# EAGLE schematic HTH-2019-Badge-PROD-RC1 (EAGLE 9.3.2)
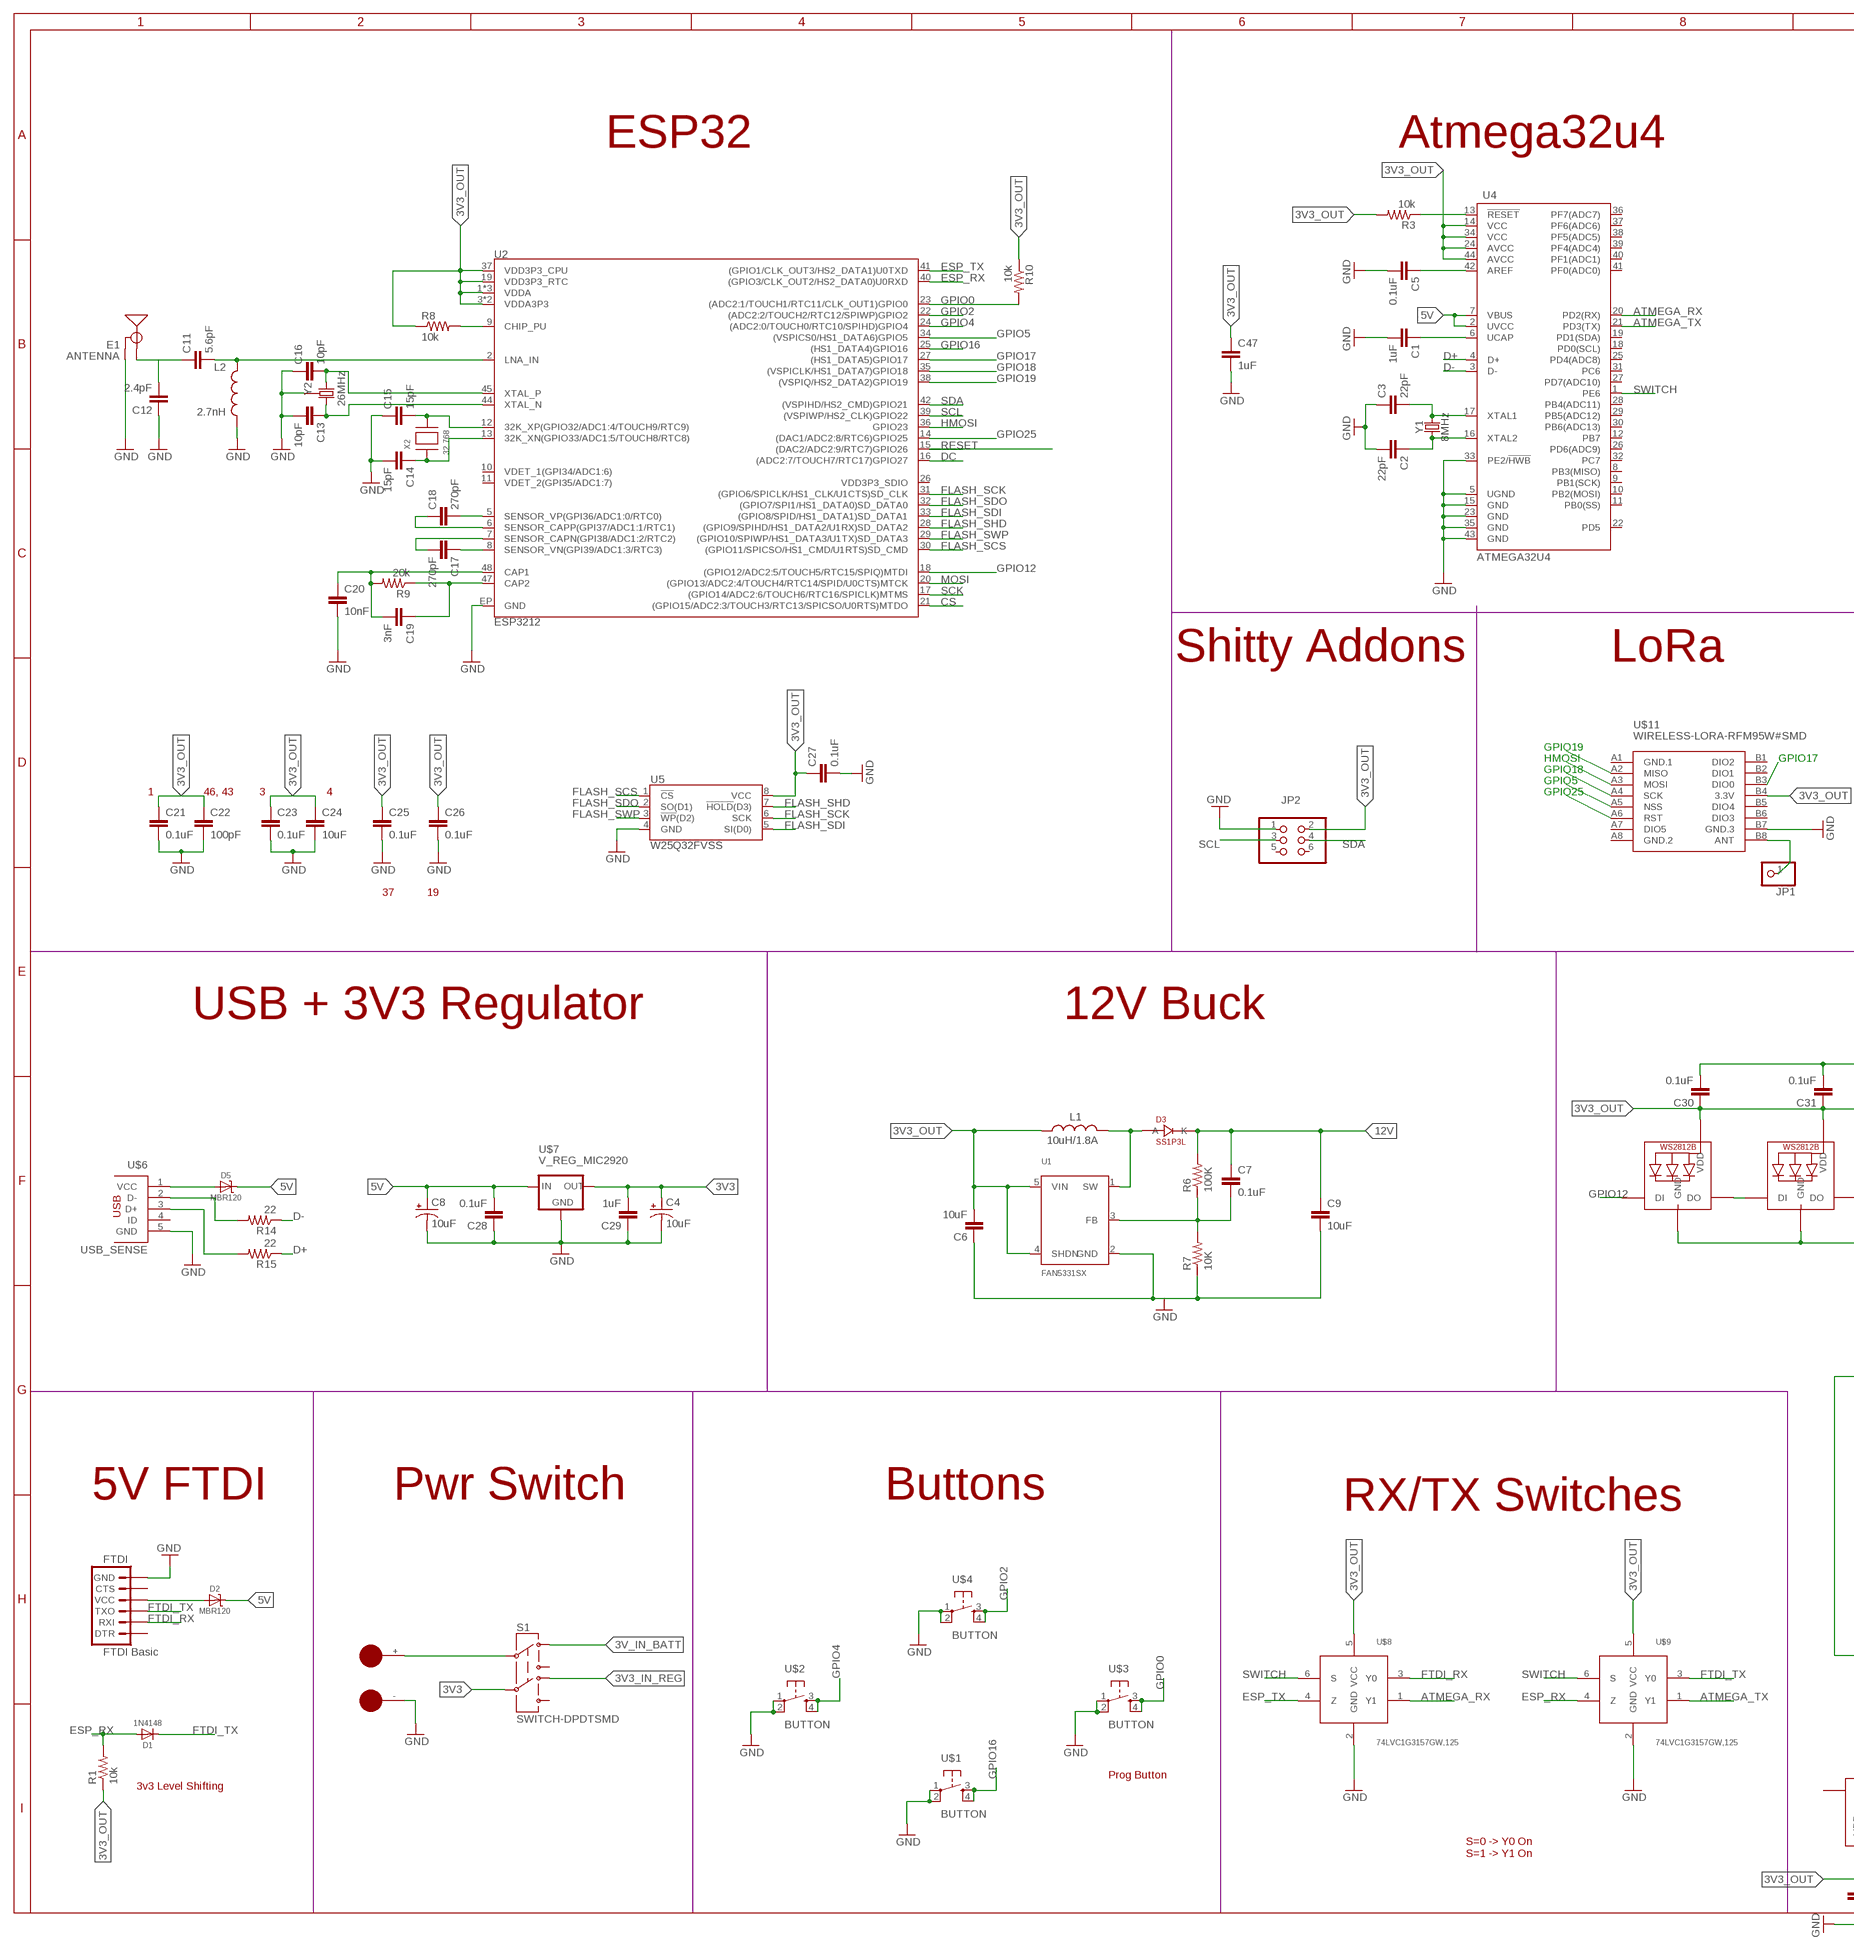
[diagram p0: schematic, sheet 1, part 1 of 2]
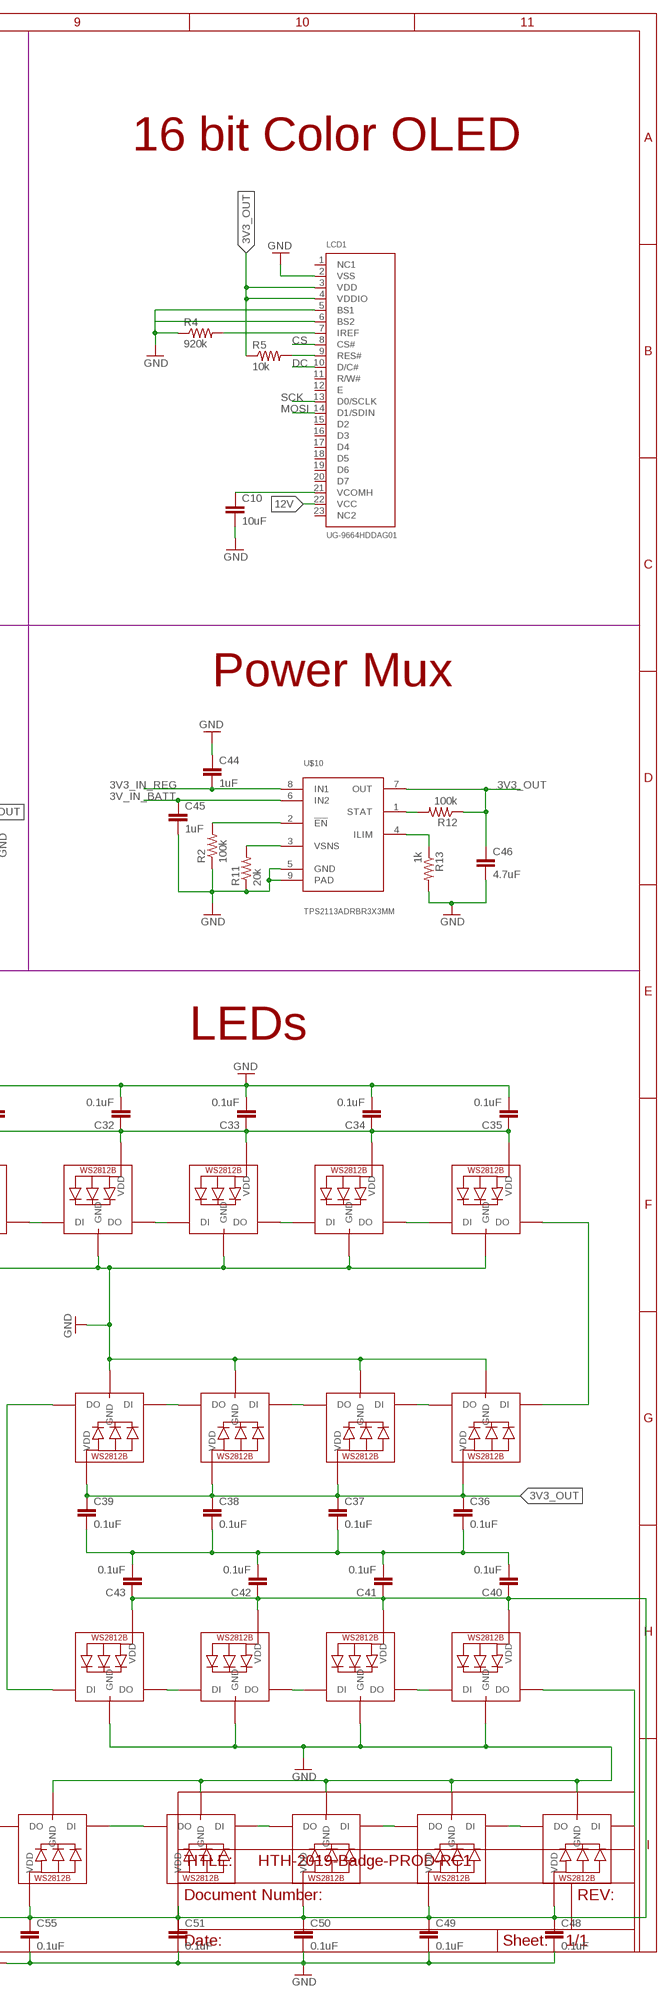
[diagram p1: schematic, sheet 1, part 2 of 2]

## Parts
C1  1uF  CAP-0603-EMPTY-VALUES  [CAP0603]
C2  22pF  CAP-0603-EMPTY-VALUES  [CAP0603]
C3  22pF  CAP-0603-EMPTY-VALUES  [CAP0603]
C4  10uF  CAP_POL1206  [EIA3216]
C5  0.1uF  CAP-0603-EMPTY-VALUES  [CAP0603]
C6  10uF  CAP-0603-10UF-10V-10%  [CAP0603]
C7  0.1uF  CAP-0603-0.1UF-25V-10%  [CAP0603]
C8  10uF  CAP_POL1206  [EIA3216]
C9  10uF  CAP-0603-10UF-25V-20%  [CAP0603]
C10  10uF  CAP-0603-EMPTY-VALUES  [CAP0603]
C11  5.6pF  CAP-0603-EMPTY-VALUES  [CAP0603]
C12  2.4pF  CAP-0603-EMPTY-VALUES  [CAP0603]
C13  10pF  CAP-0603-EMPTY-VALUES  [CAP0603]
C14  15pF  CAP-0603-EMPTY-VALUES  [CAP0603]
C15  15pF  CAP-0603-EMPTY-VALUES  [CAP0603]
C16  10pF  CAP-0603-EMPTY-VALUES  [CAP0603]
C17  270pF  CAP-0603-EMPTY-VALUES  [CAP0603]
C18  270pF  CAP-0603-EMPTY-VALUES  [CAP0603]
C19  3nF  CAP-0603-EMPTY-VALUES  [CAP0603]
C20  10nF  CAP-0603-EMPTY-VALUES  [CAP0603]
C21  0.1uF  CAP-0603-EMPTY-VALUES  [CAP0603]
C22  100pF  CAP-0603-EMPTY-VALUES  [CAP0603]
C23  0.1uF  CAP-0603-EMPTY-VALUES  [CAP0603]
C24  10uF  CAP-0603-EMPTY-VALUES  [CAP0603]
C25  0.1uF  CAP-0603-EMPTY-VALUES  [CAP0603]
C26  0.1uF  CAP-0603-EMPTY-VALUES  [CAP0603]
C27  0.1uF  CAP-0603-EMPTY-VALUES  [CAP0603]
C28  0.1uF  CAP-0603-EMPTY-VALUES  [CAP0603]
C29  1uF  CAP-0603-EMPTY-VALUES  [CAP0603]
C30  0.1uF  CAP-0603-EMPTY-VALUES  [CAP0603]
C31  0.1uF  CAP-0603-EMPTY-VALUES  [CAP0603]
C32  0.1uF  CAP-0603-EMPTY-VALUES  [CAP0603]
C33  0.1uF  CAP-0603-EMPTY-VALUES  [CAP0603]
C34  0.1uF  CAP-0603-EMPTY-VALUES  [CAP0603]
C35  0.1uF  CAP-0603-EMPTY-VALUES  [CAP0603]
C36  0.1uF  CAP-0603-EMPTY-VALUES  [CAP0603]
C37  0.1uF  CAP-0603-EMPTY-VALUES  [CAP0603]
C38  0.1uF  CAP-0603-EMPTY-VALUES  [CAP0603]
C39  0.1uF  CAP-0603-EMPTY-VALUES  [CAP0603]
C40  0.1uF  CAP-0603-EMPTY-VALUES  [CAP0603]
C41  0.1uF  CAP-0603-EMPTY-VALUES  [CAP0603]
C42  0.1uF  CAP-0603-EMPTY-VALUES  [CAP0603]
C43  0.1uF  CAP-0603-EMPTY-VALUES  [CAP0603]
C44  1uF  CAP-0603-EMPTY-VALUES  [CAP0603]
C45  1uF  CAP-0603-EMPTY-VALUES  [CAP0603]
C46  4.7uF  CAP-0603-EMPTY-VALUES  [CAP0603]
C47  1uF  CAP-0603-EMPTY-VALUES  [CAP0603]
C48  0.1uF  CAP-0603-EMPTY-VALUES  [CAP0603]
C49  0.1uF  CAP-0603-EMPTY-VALUES  [CAP0603]
C50  0.1uF  CAP-0603-EMPTY-VALUES  [CAP0603]
C51  0.1uF  CAP-0603-EMPTY-VALUES  [CAP0603]
C55  0.1uF  CAP-0603-EMPTY-VALUES  [CAP0603]
D1  1N4148  DIODESOD-323  [SOD-323]
D2  MBR120  DIODE-SCHOTTKYSOD-123  [SOD-123]
D3  SS1P3L  [DO220AAL]
D5  MBR120  DIODE-SCHOTTKYSOD-123  [SOD-123]
E1  ANTENNA  ANTENNATRACE-TUNED  [TRACE_ANTENNA_2.4GHZ_25.7MM_TUNED]
FTDI  FTDI Basic  ARDUINO_SERIAL_PROGRAMPTH  [1X06]
JP1  PINHD-1X1  [1X01]
JP2  PINHD-2X3  [2X03]
L1  10uH/1.8A  INDUCTORSRU5028  [SRU5028]
L2  2.7nH  INDUCTOR0603  [0603]
LCD1  UG-9664HDDAG01  DISP_OLED_UG-9664HDDAG01WRAPAROUND  [UG-9664HDDAG01_WRAPAROUND]
LED1  WS2812B3535  [LED3535]
LED2  WS2812B3535  [LED3535]
LED3  WS2812B3535  [LED3535]
LED4  WS2812B3535  [LED3535]
LED5  WS2812B3535  [LED3535]
LED6  WS2812B3535  [LED3535]
LED7  WS2812B3535  [LED3535]
LED8  WS2812B3535  [LED3535]
LED9  WS2812B3535  [LED3535]
LED10  WS2812B3535  [LED3535]
LED11  WS2812B3535  [LED3535]
LED12  WS2812B3535  [LED3535]
LED13  WS2812B3535  [LED3535]
LED14  WS2812B3535  [LED3535]
LED15  WS2812B3535  [LED3535]
LED16  WS2812B3535  [LED3535]
LED17  WS2812B3535  [LED3535]
LED18  WS2812B3535  [LED3535]
LED19  WS2812B3535  [LED3535]
R1  10k  RES-0603_EMPTY-FIELDS  [RES-0603]
R2  100k  RES-0603_EMPTY-FIELDS  [RES-0603]
R3  10k  RES-0603_EMPTY-FIELDS  [RES-0603]
R4  920k  RES-0603_EMPTY-FIELDS  [RES-0603]
R5  10k  RES-0603_EMPTY-FIELDS  [RES-0603]
R6  100K  RES-0603-100K-5%  [RES-0603]
R7  10K  RES-0603-10K-5%  [RES-0603]
R8  10k  RES-0603_EMPTY-FIELDS  [RES-0603]
R9  20k  RES-0603_EMPTY-FIELDS  [RES-0603]
R10  10k  RES-0603_EMPTY-FIELDS  [RES-0603]
R11  20k  RES-0603_EMPTY-FIELDS  [RES-0603]
R12  100k  RES-0603_EMPTY-FIELDS  [RES-0603]
R13  1k  RES-0603_EMPTY-FIELDS  [RES-0603]
R14  22  RES-0603_EMPTY-FIELDS  [RES-0603]
R15  22  RES-0603_EMPTY-FIELDS  [RES-0603]
S1  SWITCH-DPDTSMD  [AYZ0202]
U1  FAN5331SX  FAN5331  [SOT23-5]
U2  ESP3212  [QFN48-0.4MM]
U4  ATMEGA32U4  ATMEGA32U4OUTFAKES  [QFN-44-NOPAD_1:1-OUTFAKES]
U5  W25Q32FVSS  [SOIC-8]
U$1  BUTTON  [BUTTON]
U$2  BUTTON  [BUTTON]
U$3  BUTTON  [BUTTON]
U$4  BUTTON  [BUTTON]
U$5  BAT_HOLD  [AA]
U$6  USB_SENSE  [USB-MICRO-TH-SUPPORT]
U$7  V_REG_MIC2920  [SOT223]
U$8  74LVC1G3157GW,125  [SOT-363]
U$9  74LVC1G3157GW,125  [SOT-363]
U$10  TPS2113ADRBR3X3MM  [8-VDFN]
U$11  WIRELESS-LORA-RFM95W#SMD  [WIRELESS-LORA-RFM95W#SMD]
X2  32.768  XTAL-3.2X1.5  [XTAL3215]
Y1  8MHz  CRYSTAL-8MHZSMD-5X3.2  [CRYSTAL-SMD-5X3.2-4PAD]
Y2  26MHz  CRYSTAL-GROUNDED3.2X2.5  [CRYSTAL-SMD-3.2X2.5]

## Nets
3V3: C4.A(+) C29.2 S1.5 U$7.3(OUT)
3V3_IN_REG: C44.2 S1.4 U$10.8(IN1)
3V3_OUT: C6.2 C21.1 C22.1 C23.1 C24.1 C25.1 C26.1 C27.1 C30.1 C31.1 C32.1 C33.1 C34.1 C35.1 C36.1 C37.1 C38.1 C39.1 C40.1 C41.1 C42.1 C43.1 C46.1 C47.1 C48.1 C49.1 C50.1 C51.1 C55.1 JP2.2 L1.1 LCD1.3(VDD) LCD1.4(VDDIO) LED1.2(VDD) LED2.2(VDD) LED3.2(VDD) LED4.2(VDD) LED5.2(VDD) LED6.2(VDD) LED7.2(VDD) LED8.2(VDD) LED9.2(VDD) LED10.2(VDD) LED11.2(VDD) LED12.2(VDD) LED13.2(VDD) LED14.2(VDD) LED15.2(VDD) LED16.2(VDD) LED17.2(VDD) LED18.2(VDD) LED19.2(VDD) R1.1 R3.2 R5.1 R8.1 R10.1 R12.1 U1.4(SHDN) U1.5(VIN) U2.1(VDDA) U2.3(VDDA3P3) U2.4(VDDA3P3) U2.19(VDD3P3_RTC) U2.37(VDD3P3_CPU) U2.43(VDDA) U2.46(VDDA) U4.14(VCC) U4.24(AVCC) U4.34(VCC) U4.44(AVCC) U5.8(VCC) U$8.5(VCC) U$9.5(VCC) U$10.7(OUT) U$11.B4(3.3V)
3V_IN_BATT: C45.1 S1.1 U$10.6(IN2)
5V: C8.A(+) C28.2 D2.C D5.C U4.2(UVCC) U4.7(VBUS) U$7.1(IN)
12V: C7.1 C9.1 D3.P$1(K) LCD1.22(VCC) R6.2
ATMEGA_RX: U4.20(PD2(RX)) U$8.1(Y1)
ATMEGA_TX: U4.21(PD3(TX)) U$9.1(Y1)
CS: LCD1.8(CS#) U2.21((GPIO15/ADC2:3/TOUCH3/RTC13/SPICSO/U0RTS)MTDO)
D+: R15.1 U4.4(D+)
D-: R14.1 U4.3(D-)
DC: LCD1.10(D/C#) U2.16((ADC2:7/TOUCH7/RTC17)GPIO27)
ESP_RX: D1.A R1.2 U2.40((GPIO3/CLK_OUT2/HS2_DATA0)U0RXD) U$9.4(Z)
ESP_TX: U2.41((GPIO1/CLK_OUT3/HS2_DATA1)U0TXD) U$8.4(Z)
FLASH_SCK: U2.31((GPIO6/SPICLK/HS1_CLK/U1CTS)SD_CLK) U5.6(SCK)
FLASH_SCS: U2.30((GPIO11/SPICSO/HS1_CMD/U1RTS)SD_CMD) U5.1(!CS!)
FLASH_SDI: U2.33((GPIO8/SPID/HS1_DATA1)SD_DATA1) U5.5(SI(D0))
FLASH_SDO: U2.32((GPIO7/SPI1/HS1_DATA0)SD_DATA0) U5.2(SO(D1))
FLASH_SHD: U2.28((GPIO9/SPIHD/HS1_DATA2/U1RX)SD_DATA2) U5.7(!HOLD!(D3))
FLASH_SWP: U2.29((GPIO10/SPIWP/HS1_DATA3/U1TX)SD_DATA3) U5.3(!WP!(D2))
FTDI_RX: FTDI.2(RXI) U$8.3(Y0)
FTDI_TX: D1.C FTDI.3(TXO) U$9.3(Y0)
GND: C1.2 C2.2 C3.1 C4.C(-) C5.2 C6.1 C8.C(-) C9.2 C10.2 C12.1 C13.2 C14.2 C15.1 C16.1 C20.2 C21.2 C22.2 C23.2 C24.2 C25.2 C26.2 C27.2 C28.1 C29.1 C30.2 C31.2 C32.2 C33.2 C34.2 C35.2 C44.1 C45.2 C46.2 C47.2 C48.2 C49.2 C50.2 C51.2 C55.2 E1.GND E1.GND2(GND) FTDI.6(GND) JP2.1 L2.2 LCD1.2(VSS) LCD1.5(BS1) LED1.4(GND) LED2.4(GND) LED3.4(GND) LED4.4(GND) LED5.4(GND) LED6.4(GND) LED7.4(GND) LED8.4(GND) LED9.4(GND) LED10.4(GND) LED11.4(GND) LED12.4(GND) LED13.4(GND) LED14.4(GND) LED15.4(GND) LED16.4(GND) LED17.4(GND) LED18.4(GND) LED19.4(GND) R2.1 R4.1 R7.1 R11.1 R13.2 U1.2(GND) U2.EP(GND) U4.5(UGND) U4.15(GND) U4.23(GND) U4.33(PE2/!HWB) U4.35(GND) U4.43(GND) U5.4(GND) U$1.1 U$1.2 U$2.1 U$2.2 U$3.1 U$3.2 U$4.1 U$4.2 U$5.- U$6.5(GND) U$7.2(GND) U$7.4(GND) U$8.2(GND) U$9.2(GND) U$10.5(GND) U$10.9(PAD) U$11.B7(GND.3) Y2.2(GND) Y2.4(GND)
GPIO0: R10.2 U2.23((ADC2:1/TOUCH1/RTC11/CLK_OUT1)GPIO0) U$3.3 U$3.4
GPIO2: U2.22((ADC2:2/TOUCH2/RTC12/SPIWP)GPIO2) U$4.3 U$4.4
GPIO4: U2.24((ADC2:0/TOUCH0/RTC10/SPIHD)GPIO4) U$2.3 U$2.4
GPIO5: U2.34((VSPICS0/HS1_DATA6)GPIO5) U$11.A5(NSS)
GPIO12: LED5.1(DI) U2.18((GPIO12/ADC2:5/TOUCH5/RTC15/SPIQ)MTDI)
GPIO16: U2.25((HS1_DATA4)GPIO16) U$1.3 U$1.4
GPIO17: U2.27((HS1_DATA5)GPIO17) U$11.B3(DIO0)
GPIO18: U2.35((VSPICLK/HS1_DATA7)GPIO18) U$11.A4(SCK)
GPIO19: U2.38((VSPIQ/HS2_DATA2)GPIO19) U$11.A2(MISO)
GPIO25: U2.14((DAC1/ADC2:8/RTC6)GPIO25) U$11.A6(RST)
HMOSI: U2.36(GPIO23) U$11.A3(MOSI)
MOSI: LCD1.14(D1/SDIN) U2.20((GPIO13/ADC2:4/TOUCH4/RTC14/SPID/U0CTS)MTCK)
N$1: C3.2 U4.17(XTAL1) Y1.3
N$2: R3.1 U4.13(!RESET)
N$3: C1.1 U4.6(UCAP)
N$4: C5.1 U4.42(AREF)
N$5: R14.2 U$6.2(D-)
N$6: C10.1 LCD1.21(VCOMH)
N$7: D3.P$2(A) L1.2 U1.1(SW)
N$8: C2.1 U4.16(XTAL2) Y1.1
N$9: LCD1.6(BS2)
N$10: LED1.1(DI) LED14.3(DO)
N$11: C7.2 R6.1 R7.2 U1.3(FB)
N$13: LCD1.7(IREF) R4.2
N$14: S1.2 U$5.+
N$15: R8.2 U2.9(CHIP_PU)
N$16: C16.2 U2.45(XTAL_P) Y2.1
N$17: C11.1 C12.2 E1.ANT(SIGNAL)
N$19: LED1.3(DO) LED2.1(DI)
N$20: D2.A FTDI.4(VCC)
N$21: LED5.3(DO) LED6.1(DI)
N$22: C19.2 C20.1 R9.2 U2.48(CAP1)
N$23: C11.2 L2.1 U2.2(LNA_IN)
N$24: C13.1 U2.44(XTAL_N) Y2.3
N$25: C19.1 R9.1 U2.47(CAP2)
N$26: C15.2 U2.12(32K_XP(GPIO32/ADC1:4/TOUCH9/RTC9)) X2.P$2
N$27: C14.1 U2.13(32K_XN(GPIO33/ADC1:5/TOUCH8/RTC8)) X2.P$1
N$28: C18.2 U2.5(SENSOR_VP(GPI36/ADC1:0/RTC0))
N$29: C18.1 U2.6(SENSOR_CAPP(GPI37/ADC1:1/RTC1))
N$30: C17.2 U2.7(SENSOR_CAPN(GPI38/ADC1:2/RTC2))
N$31: C17.1 U2.8(SENSOR_VN(GPI39/ADC1:3/RTC3))
N$32: D5.A U$6.1(VCC)
N$33: LED6.3(DO) LED7.1(DI)
N$34: LED7.3(DO) LED8.1(DI)
N$35: LED8.3(DO) LED9.1(DI)
N$36: LED9.3(DO) LED11.1(DI)
N$37: LED11.3(DO) LED13.1(DI)
N$38: LED10.1(DI) LED13.3(DO)
N$39: LED10.3(DO) LED12.1(DI)
N$40: LED12.3(DO) LED14.1(DI)
N$41: LED2.3(DO) LED3.1(DI)
N$42: LED3.3(DO) LED4.1(DI)
N$43: LED15.3(DO) LED16.1(DI)
N$44: LED16.3(DO) LED17.1(DI)
N$45: R15.2 U$6.3(D+)
N$46: LED17.3(DO) LED18.1(DI)
N$47: JP1.1 U$11.B8(ANT)
N$48: C36.2 C37.2 C38.2 C39.2 C40.2 C41.2 C42.2 C43.2
N$49: LED4.3(DO) LED15.1(DI)
N$51: LED18.3(DO) LED19.1(DI)
N$53: R2.2 U$10.2(!EN)
N$54: R11.2 U$10.3(VSNS)
N$58: R12.2 U$10.1(STAT)
N$60: R13.1 U$10.4(ILIM)
RESET: LCD1.9(RES#) R5.2 U2.15((DAC2/ADC2:9/RTC7)GPIO26)
SCK: LCD1.13(D0/SCLK) U2.17((GPIO14/ADC2:6/TOUCH6/RTC16/SPICLK)MTMS)
SCL: JP2.3 U2.39((VSPIWP/HS2_CLK)GPIO22)
SDA: JP2.4 U2.42((VSPIHD/HS2_CMD)GPIO21)
SWITCH: U4.1(PE6) U$8.6(S) U$9.6(S)
Unconnected: FTDI.1(DTR) FTDI.5(CTS) JP2.5 JP2.6 LCD1.1(NC1) LCD1.11(R/W#) LCD1.12(E) LCD1.15(D2) LCD1.16(D3) LCD1.17(D4) LCD1.18(D5) LCD1.19(D6) LCD1.20(D7) LCD1.23(NC2) LED19.3(DO) S1.3 S1.6 U2.10(VDET_1(GPI34/ADC1:6)) U2.11(VDET_2(GPI35/ADC1:7)) U2.26(VDD3P3_SDIO) U4.8(PB3(MISO)) U4.9(PB1(SCK)) U4.10(PB2(MOSI)) U4.11(PB0(SS)) U4.12(PB7) U4.18(PD0(SCL)) U4.19(PD1(SDA)) U4.22(PD5) U4.25(PD4(ADC8)) U4.26(PD6(ADC9)) U4.27(PD7(ADC10)) U4.28(PB4(ADC11)) U4.29(PB5(ADC12)) U4.30(PB6(ADC13)) U4.31(PC6) U4.32(PC7) U4.36(PF7(ADC7)) U4.37(PF6(ADC6)) U4.38(PF5(ADC5)) U4.39(PF4(ADC4)) U4.40(PF1(ADC1)) U4.41(PF0(ADC0)) U$6.4(ID) U$11.A7(DIO5) U$11.B1(DIO2) U$11.B2(DIO1) U$11.B5(DIO4) U$11.B6(DIO3)

## Notes on the sheet
- ESP32 | Atmega32u4 | 16 bit Color OLED
- Shitty Addons | LoRa | Power Mux
- 1 | 46, 43 | 3 | 4
- 37 | 19
- USB + 3V3 Regulator | 12V Buck | LEDs
- 5V FTDI | Pwr Switch | Buttons | RX/TX Switches
- Prog Button
- 3v3 Level Shifting
- S=0 -> Y0 On
  S=1 -> Y1 On

## Power pins joined to a net without a drawn wire
GND.1: U$11.A1(GND.1)
GND.2: U$11.A8(GND.2)

## Library data of the parts
C1-C3 C5 C10-C51 C55 = Jaycon OPL Capacitors:CAP-0603: Jaycon Systems OPL Capacitors 0603 Package. The name for the part has the Value - Voltage - Tolerance making part selection simple.; SIZE: 0603
C4 C8 = SparkFun-Passives:CAP_POL: Capacitor Polarized These are standard SMD and PTH capacitors. Normally 10uF, 47uF, and 100uF in electrolytic and tantalum varieties. Always verify the external diameter of the through hole cap, it varies with capacity, voltage, and manufacturer. The EIA devices should be standard.
C6 = Jaycon OPL Capacitors:CAP-0603: Jaycon Systems OPL Capacitors 0603 Package. The name for the part has the Value - Voltage - Tolerance making part selection simple.; JAYCON: CP-0070; MFG#1: GRM188R61A106KE69D; SIZE: 0603; TEMPERATURE-COEFFICIENT: X5R; TOLERANCE: 10%; VOLTAGE: 10V
C7 = Jaycon OPL Capacitors:CAP-0603: Jaycon Systems OPL Capacitors 0603 Package. The name for the part has the Value - Voltage - Tolerance making part selection simple.; JAYCON: CP-0066; MFG#1: C1608X7R1E104KT; SIZE: 0603; TEMPERATURE-COEFFICIENT: X7R; TOLERANCE: 10%; VOLTAGE: 25V
C9 = Jaycon OPL Capacitors:CAP-0603: Jaycon Systems OPL Capacitors 0603 Package. The name for the part has the Value - Voltage - Tolerance making part selection simple.; JAYCON: CP-0044; MFG#1: CL10A106MA8NRNC; SIZE: 0603; TEMPERATURE-COEFFICIENT: X5R; TOLERANCE: 20%; VOLTAGE: 25V
D1 = microbuilder:DIODE: Diode SMA Model Volts Amps Type Vf Ir Digikey # Notes SSA34-E3 40V 3A Schottky 480mV @ 3A 200uA @ 40V SSA34-E3/61TGITR-ND CDBA120-G 20V 1A Schottky 500mV @ 1A 500uA @ 20V 641-1014-6-ND REEL MBRA210 10V 2A Schottky 350mV @ 2A 700uA @ 10V MBRA210LT3 SOD-123 Model Volts Amps Type Vf Ir Order # Notes BAT54T1G 30V 200mA Schottky 800mV @ 200mA 2uA @ 25V BAT54T1GOSTR-ND B0530W 30V 500mA Schottky 430mV @ 500mA 130uA @ 30V B0530W-FDICT-ND REEL MBR120 20V 1A Schottky 340mV @ 1A MBR120VLSFT1GOSCT-ND SOD-323 Model Volts Amps Type Vf Ir Order # Notes PMEG2005EJ 20V 500mA Schottky 355mV @ 500mA 568-4110-1-ND ZLLS410 10V 570mA Schottky 380mV @ 570mA ZLLS410CT-ND 1N4148WS 75V 150mA Silicon/Simple 1V 1N4148WSFSCT-ND REEL SOD-523 Model Volts Amps Type Vf Ir Order # Notes BAT54XV2 30V 200mA Schottky 0.8V @ 100mA BAT54XV2CT-ND TB751S 30V 30mA Schottky RB751S-40TE61CT-ND SOT23-R/W (R = Solder Paste/Reflow Ovens, W = Hand-Soldering) Model Volts Amps Type Vf Ir Order # Notes BAT54FILM 40V 300mA Schottky 497-7162-1-ND POWERDI-5 Model Volts Amps Type Vf Ir Order # Notes PDS560 60V 5A Schottky 670mV @ 5A 150uA @ 60V PDS560DICT-ND
D2 D5 = microbuilder:DIODE-SCHOTTKY
D3 = SmartPrj:SS1P3L; OC_NEWARK: unknown
E1 = esp32-thing-temp:ANTENNA: Chip antenna Chip antenna with ground or secondary connection. Common with larger metal RF connectors.
FTDI = SparkFun:ARDUINO_SERIAL_PROGRAM
JP1 = pinhead:PINHD-1X1: PIN HEADER
JP2 = pinhead:PINHD-2X3: PIN HEADER
L1 = SparkFun:INDUCTOR: Inductors
L2 = SparkFun-Passives:INDUCTOR: Inductors; PROD_ID: NDUC-08762
LCD1 = microbuilder:DISP_OLED_UG-9664HDDAG01: OLED 96x64 Pixel, 0.95" 65K Color
LED1-LED19 = adafruit:WS2812B
R1-R5 R8-R15 = Jaycon OPL Resistors:RES-0603: SMD 0603 Resistor Library; SIZE: 0603; WATTAGE: 0.1W
R6 = Jaycon OPL Resistors:RES-0603: SMD 0603 Resistor Library; JAYCON: RS-0013; SIZE: 0603; TOLERANCE: 5%; VISHAY-MFG: RCG0603100KJNEA; WATTAGE: 0.1W
R7 = Jaycon OPL Resistors:RES-0603: SMD 0603 Resistor Library; JAYCON: RS-0027; ROHM-MFG: MCR03EZPJ103; SAMSUNG-MFG: RC1608J103CS; SIZE: 0603; TOLERANCE: 5%; VISHAY-MFG: CRCW060310K0JNEA; WATTAGE: 0.1W; YAGEO-MFG: RC0603JR-0710KP
S1 = SparkFun:SWITCH-DPDT: DPDT Version of the COM-00597
U1 = microbuilder:FAN5331: FAN5331 - LED/OLED 20V Boost Converter Digikey: FAN5331SXCT-ND
U2 = esp32-thing-temp:ESP3212; PROD_ID: IC-13338
U4 = Testing:ATMEGA32U4: Atmel 44-pin 8-bit Microcontroller with 32KBytes of ISP Flash and USB Controller
U5 = SparkFun-DigitalIC:W25Q32FV: Winbond W25Q32FV 32Mbit (4MB) Flash The W25Q32FV support the standard Serial Peripheral Interface (SPI), Dual/Quad I/O SPI as well as 2-clocks instruction cycle Quad Peripheral Interface (QPI). Datasheet <http://www.winbond.com/resource-files/w25q32fv%20revh%20091613.pdf>; PROD_ID: IC-13229
U$1-U$4 = WiFiButton:BUTTON
U$5 = Badge:BAT_HOLD
U$6 = JAYCONSYSTEMS:USB_SENSE
U$7 = JAYCONSYSTEMS:V_REG_MIC2920: MIC2920A (http://www.micrel.com/_PDF/mic2920.pdf) - 400mA output LDO Regulator
U$8 U$9 = Jaycon:74LVC1G3157GW,125
U$10 = Jaycon:TPS2113ADRBR
U$11 = diy-modules:WIRELESS-LORA-RFM95W: 868/915 MHz LoRa Radio Transceiver Module based on SX1276 chip Click here to find device on ebay.com <http://www.ebay.com/sch/RFM95W+transceiver>
X2 = adafruit2:XTAL: Low cost SMT crystals, no capacitors included http://www.ladyada.net/library/eagle
Y1 = SparkFun-Clocks:CRYSTAL-8MHZ: 8MHz Crystal Datasheet Example <http://www.futureelectronics.com/en/technologies/electromechanical/timing-devices/crystals/Pages/6008189-ABM3B-8.000MHZ-B2-T.aspx?IM=0> Frequency: 8MHz Frequency Tolerance: ±20ppm Load Capacitance: 18pF SparkFun Products: Pro Micro -3.3V/8MHz <https://www.sparkfun.com/products/12587> WAV Trigger <https://www.sparkfun.com/products/13660>; PROD_ID: XTAL-09431
Y2 = things:CRYSTAL-GROUNDED; PROD_ID: XTAL-12454